# Altium project SPI peripherals test.PrjPcb
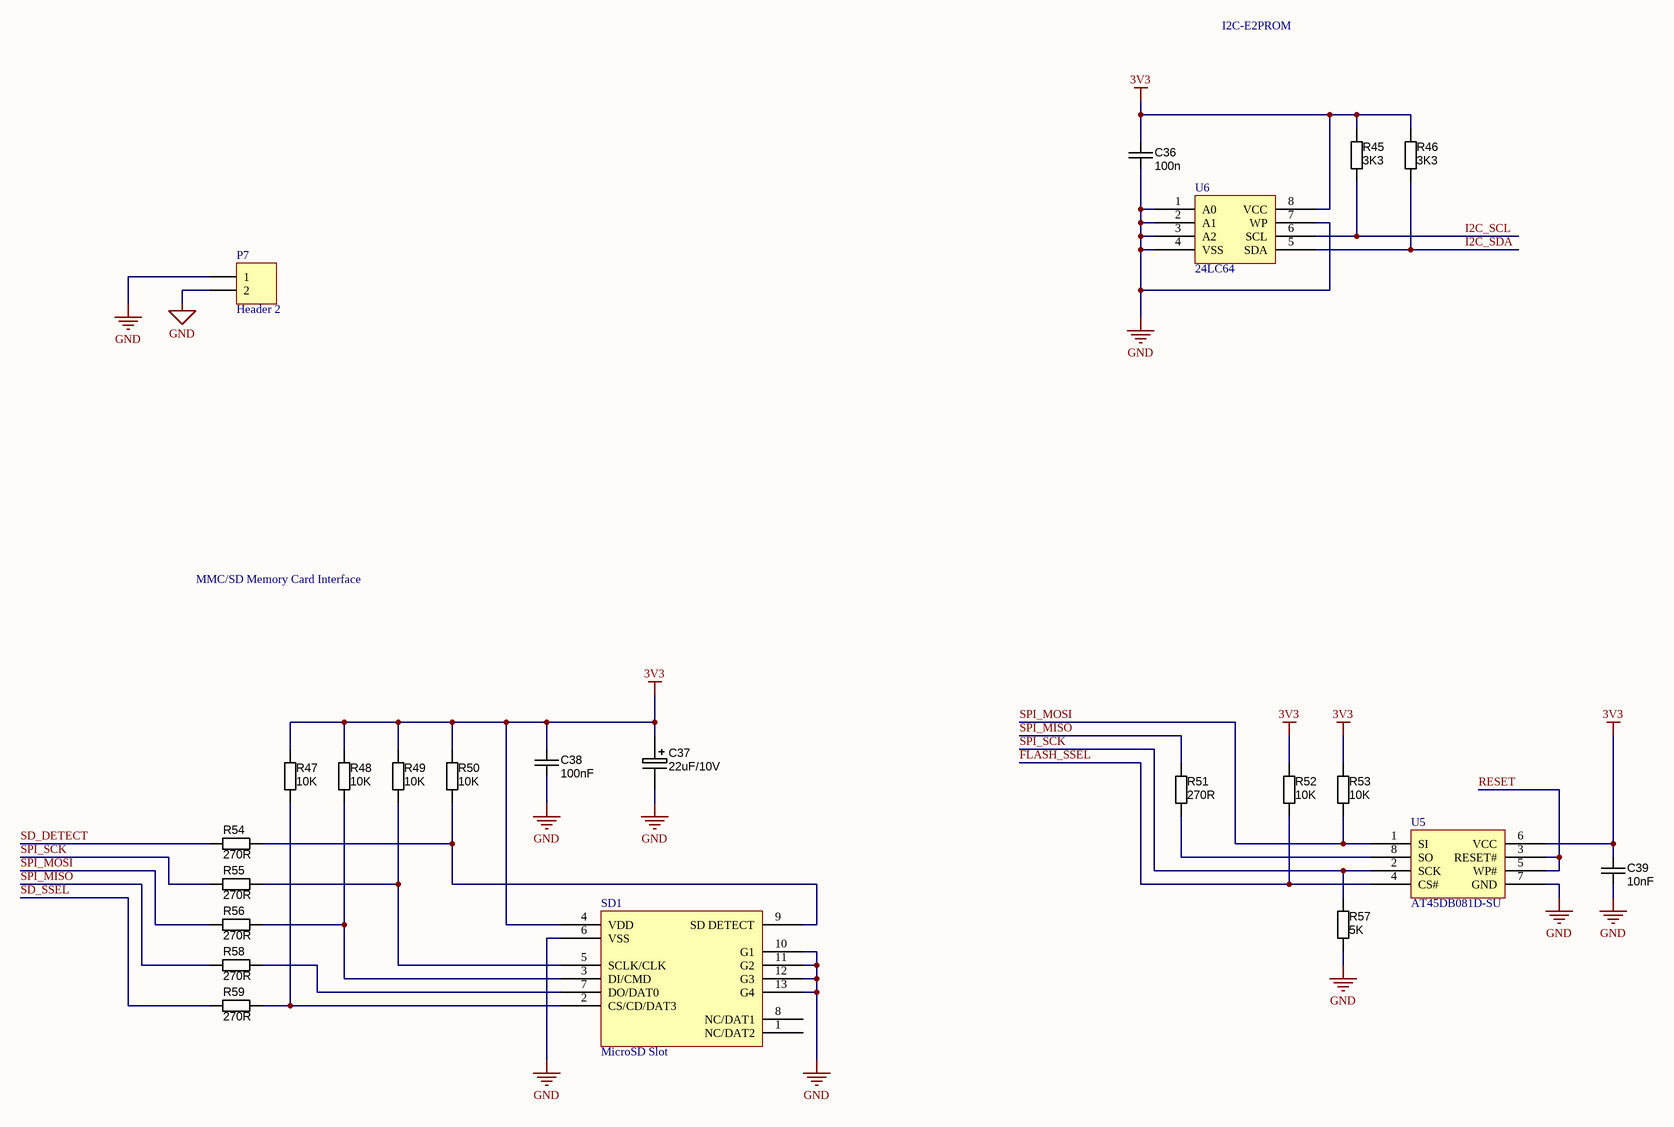
[diagram p0: SPI peripherals.SchDoc]
1 sheet, 23 parts. Net scope: global (net labels, ports and power ports of the same name join across sheets).
Board file: SPI peripherals test.PcbDoc

## Sheet SPI peripherals.SchDoc: Motor Monitoring
size A3; Organization: NTUST EE-305; Address1: No.43, Sec. 4, Keelung Rd.; Address2: Da’an Dist.; Address3: Taipei 106; Address4: Taiwan (R.O.C.); Revision: 2.0; SheetNumber: 3; SheetTotal: 4

### Parts
C36  value 100n  [CAPC1608N]  (hidden comment: approved sub OK)
C37  Ratings: 22uF/10V  [CAPC3216N]
C38  value 100nF  [CAPC1608N]  (hidden comment: approved sub OK)
C39  value 10nF  [CAPC1608N]  (hidden comment: approved sub OK)
P7  Header 2  [HDR1X2]
R45  value 3K3  [RESC1005N]  (hidden comment: Thick Film)
R46  value 3K3  [RESC1005N]  (hidden comment: Thick Film)
R47  value 10K  [RESC1005N]  (hidden comment: Thick Film)
R48  value 10K  [RESC1005N]  (hidden comment: Thick Film)
R49  value 10K  [RESC1005N]  (hidden comment: Thick Film)
R50  value 10K  [RESC1005N]  (hidden comment: Thick Film)
R51  value 270R  [RESC1005N]  (hidden comment: Thick Film)
R52  value 10K  [RESC1005N]  (hidden comment: Thick Film)
R53  value 10K  [RESC1005N]  (hidden comment: Thick Film)
R54  value 270R  [RESC1005N]  (hidden comment: Thick Film)
R55  value 270R  [RESC1005N]  (hidden comment: Thick Film)
R56  value 270R  [RESC1005N]  (hidden comment: Thick Film)
R57  value 5K  [RESC1005N]  (hidden comment: Thick Film)
R58  value 270R  [RESC1005N]  (hidden comment: Thick Film)
R59  value 270R  [RESC1005N]  (hidden comment: Thick Film)
SD1  MicroSD Slot  [MICROSD Slot]
U5  AT45DB081D-SU  [SOIJ-SM8_N]
U6  24LC64  [SOIJ-SM8_N]

### Nets
3V3: C36.1 C37.1 C38.1 C39.2 R45.1 R46.1 R47.2 R48.2 R49.2 R50.2 R52.1 R53.1 SD1.4(VDD) U5.6(VCC) U6.8(VCC)
GND: C36.2 C37.2 C38.2 C39.1 P7.1 P7.2 R57.2 SD1.6(VSS) SD1.10(G1) SD1.11(G2) SD1.12(G3) SD1.13(G4) U5.7(GND) U6.1(A0) U6.2(A1) U6.3(A2) U6.4(VSS) U6.7(WP)
FLASH_SSEL: R52.2 U5.4(CS#)
I2C_SCL: R45.2 U6.6(SCL)
I2C_SDA: R46.2 U6.5(SDA)
RESET: U5.3(RESET#) U5.5(WP#)
SD_DETECT: R54.2
SD_SSEL: R59.2
SPI_MISO: R51.1 R58.2
SPI_MOSI: R53.2 R56.2 U5.1(SI)
SPI_SCK: R55.2 R57.1 U5.2(SCK)
NetR47_1: R47.1 R59.1 SD1.2(CS/CD/DAT3)
NetR48_1: R48.1 R56.1 SD1.3(DI/CMD)
NetR49_1: R49.1 R55.1 SD1.5(SCLK/CLK)
NetR50_1: R50.1 R54.1 SD1.9(SD_DETECT)
NetR51_2: R51.2 U5.8(SO)
NetR58_1: R58.1 SD1.7(DO/DAT0)

Not connected (* = marked no-connect by the designer): SD1 1(NC/DAT2) 8(NC/DAT1)

### Notes on the sheet
- I2C-E2PROM
- MMC/SD Memory Card Interface
- Title
- Name
- Size:
- Revision:
- A3
- Date:
- Time:
- Sheet
- of

### Library data of the parts
C36 C38 C39 = CAPC_100n_0805: Capacitor SMD Cer 100nF 10% 50V X7R 0805; Manufacturer 1: Kemet; Manufacturer Part Number 1: C0805C104K5RACTU; Tolerance: ?0%; Ratings: 50V; X7R; Material: ceramic; Package / Case: 0805 (2012 metric); Supplier 1: Digi-Key; Supplier Part Number 1: 399-1170-1-ND
C37 = CAPT_1u_0805_10V: Capacitor SMD Tantalum 1uF 20% 10V 0805; Manufacturer 1: AVX Corporation; Manufacturer Part Number 1: TAJP106M010RNJ; Manufacturer Size Code: P; Tolerance: ?0%; ESR (Equivalent Series Resistance): 6.000 Ohm; Type: Molded; Operating Tem: -55蚓 ~ 125蚓; Package / Case: 0805 (2012 metric); Material: Tantalum; Supplier 1: Digi-Key; Supplier Part Number 1: 478-3281-1-ND; Size / Dimension: 0.081" L x 0.053" W (2.05mm x 1.35mm); Height - Seated (Max): 0.059" (1.50mm); ComponentLink1URL: http://www.avx.com/docs/Catalogs/tajlp.pdf; ComponentLink1Description: http://www.avx.com/docs/Catalogs/tajlp.pdf
P7 = Header 2: Header, 2-Pin; LatestRevisionDate: 17-Jul-2002; LatestRevisionNote: Re-released for DXP Platform.; Publisher: Altium Limited
R45-R59 = RES_330R_0402_5%: Resistor SMD chip 330 Ohm 0.063W 5% 0402; Manufacturer 1: Yageo; Manufacturer Part Number 1: RC0402JR-07330RL; Ratings: 1/16 W; Tolerance: ?%; Package / Case: 0402 (1005 Metric); Supplier 1: Digi-Key; Supplier Part Number 1: 311-330JRCT-ND; ComponentLink1URL: http://www.yageo.com/documents/recent/PYu-RC0402_51_RoHS_L_6.pdf; ComponentLink1Description: http://www.yageo.com/documents/recent/PYu-RC0402_51_RoHS_L_6.pdf